# EAGLE design ade7753_breakout (EAGLE 6.5.0)
AUTHOR: Prabal Dutta; REV: a; TITLE: ADE7753 Breakout
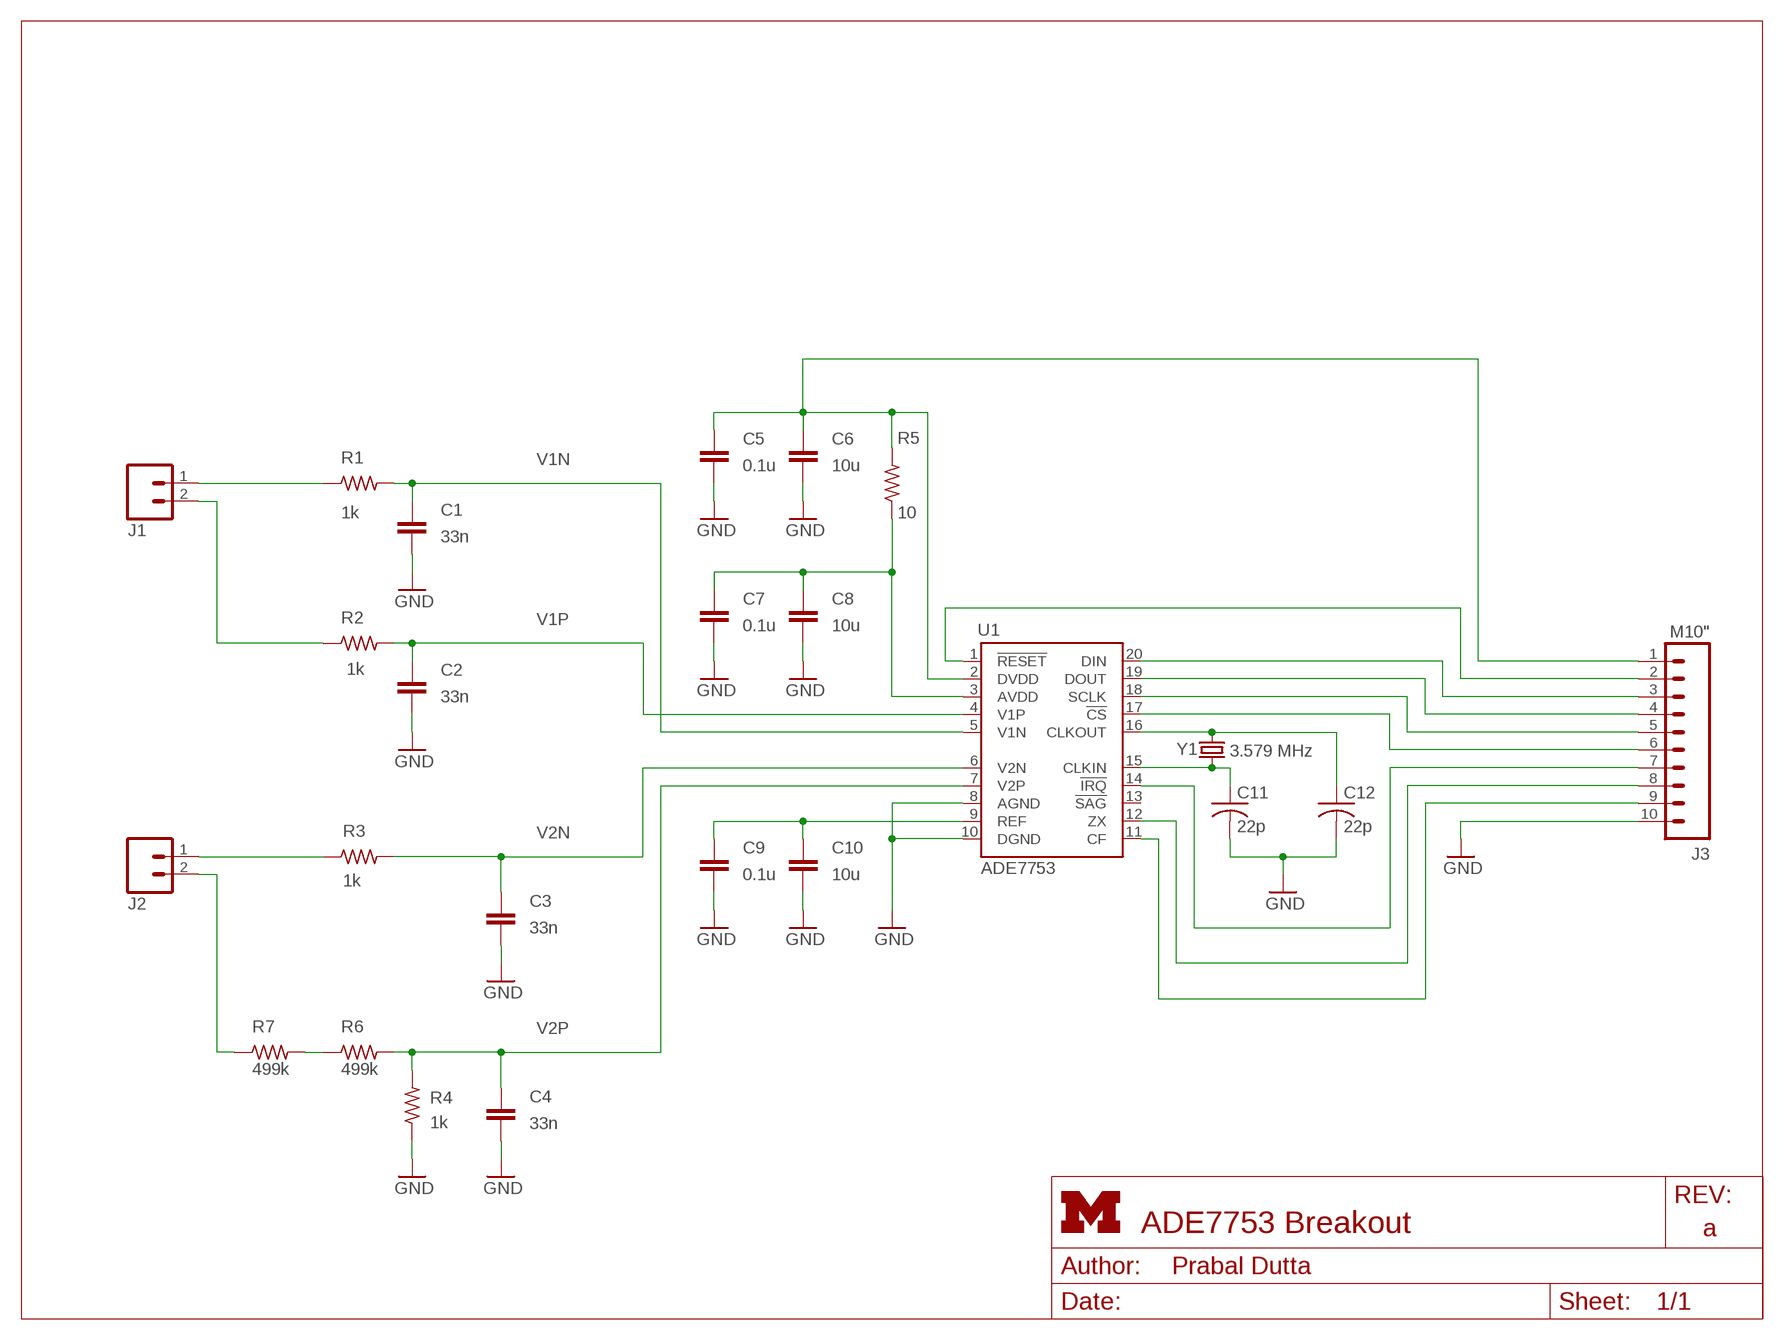
[diagram p0: schematic, sheet 1]
FRAME1 (LETTER_L): HEIGHT: 8.5in; WIDTH: 11in

## Parts
C1  33n  CAP0805  [0805]
C2  33n  CAP0805  [0805]
C3  33n  CAP0805  [0805]
C4  33n  CAP0805  [0805]
C5  0.1u  CAP0805  [0805]
C6  10u  CAP0805  [0805]
C7  0.1u  CAP0805  [0805]
C8  10u  CAP0805  [0805]
C9  0.1u  CAP0805  [0805]
C10  10u  CAP0805  [0805]
C11  22p  C-USC0603  [C0603]
C12  22p  C-USC0603  [C0603]
J1  M02PTH  [1X02]
J2  M02PTH  [1X02]
J3  M10"  [1X10]
R1  1k  R-US_R0603  [R0603]
R2  1k  R-US_R0603  [R0603]
R3  1k  R-US_R0603  [R0603]
R4  1k  R-US_R0603  [R0603]
R5  10  R-US_R0603  [R0603]
R6  499k  R-US_R0805  [R0805]
R7  499k  R-US_R0805  [R0805]
U1  ADE7753  [SSOP20]
Y1  3.579 MHz  CRYSTALHC49S  [HC49/S]

## Nets
GND: C1.2 C2.2 C3.2 C4.2 C5.2 C6.2 C7.2 C8.2 C9.2 C10.2 C11.2 C12.2 J3.10 R4.1 U1.8(AGND) U1.10(DGND)
N$1: J2.2 R7.1
N$2: J1.1 R1.1
N$22: J3.9 U1.11(CF)
N$34: C4.1 R4.2 R6.2 U1.7(V2P)
N$35: C3.1 R3.2 U1.6(V2N)
N$44: C1.1 R1.2 U1.5(V1N)
N$45: R6.1 R7.2
N$46: J1.2 R2.1
N$47: J2.1 R3.1
N$48: C2.1 R2.2 U1.4(V1P)
N$50: C9.1 C10.1 U1.9(REF)
N$51: C11.1 U1.15(CLKIN) Y1.2
N$52: C12.1 U1.16(CLKOUT) Y1.1
N$53: C7.1 C8.1 R5.1 U1.3(AVDD)
N$54: C5.1 C6.1 J3.1 R5.2 U1.2(DVDD)
N$56: J3.3 U1.20(DIN)
N$57: J3.4 U1.19(DOUT)
N$58: J3.5 U1.18(SCLK)
N$59: J3.6 U1.17(!CS)
N$60: J3.2 U1.1(!RESET)
N$61: J3.7 U1.14(!IRQ)
N$62: J3.8 U1.12(ZX)
Unconnected: U1.13(!SAG)

## Notes on the sheet
- V1N
- V1P
- V2N
- V2P

## Library data of the parts
C1-C10 = SparkFun:CAP: Capacitor Standard 0603 ceramic capacitor, and 0.1" leaded capacitor.
C11 C12 = rcl:C-US: CAPACITOR, American symbol
J1 J2 = SparkFun:M02: Header 2 Standard 2-pin 0.1" header. Use with straight break away headers (SKU : PRT-00116), right angle break away headers (PRT-00553), swiss pins (PRT-00743), machine pins (PRT-00117), and female headers (PRT-00115). Molex polarized connector foot print use with SKU : PRT-08233 with associated crimp pins and housings.
J3 = SparkFun:M10: Header 10 Standard 10-pin 0.1" header. Use with straight break away headers (SKU : PRT-00116), right angle break away headers (PRT-00553), swiss pins (PRT-00743), machine pins (PRT-00117), and female headers (PRT-00115).
R1-R7 = rcl:R-US_: RESISTOR, American symbol
U1 = berkeley-epic:ADE7753
Y1 = crystal:CRYSTAL: CRYSTAL

## Board
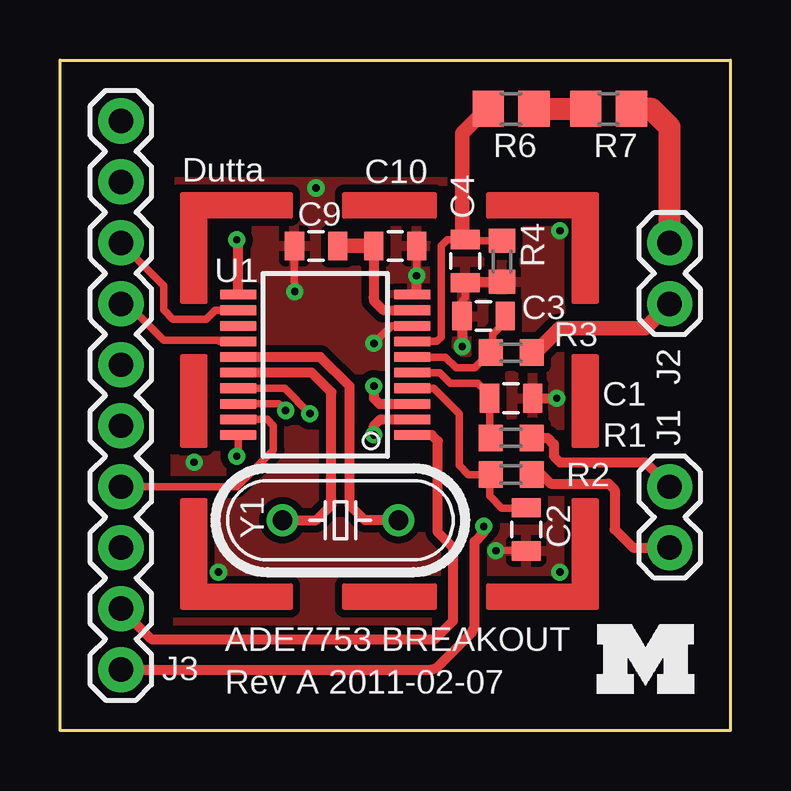
[diagram p1: board, top side]
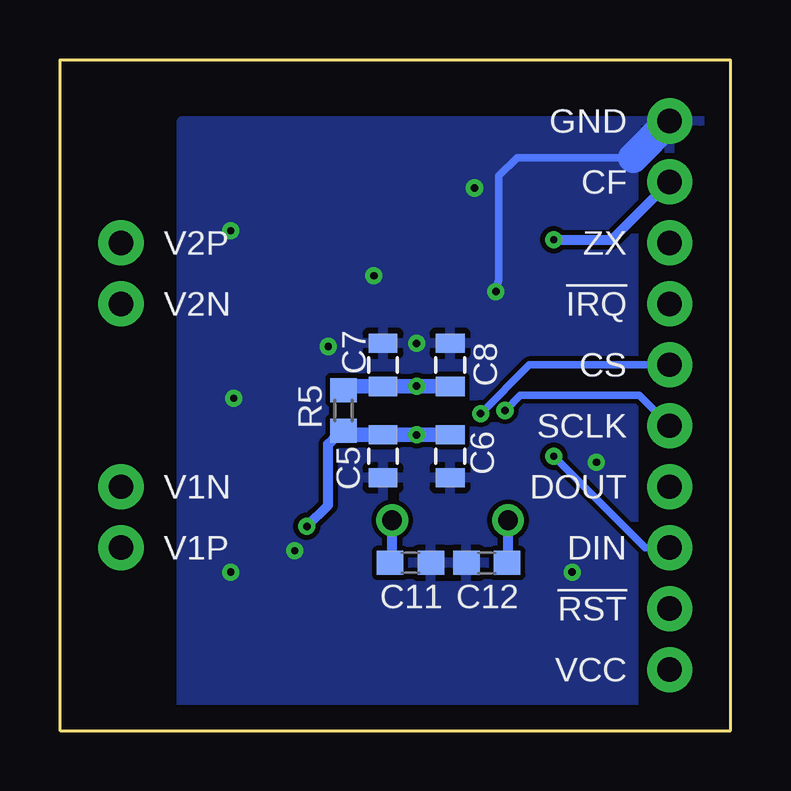
[diagram p2: board, bottom side, seen from below]

Size 27.94 x 27.94 mm. Coordinates in mm from the lower left corner, seen from the top.
Outline: 27.94,0 27.94,27.94 0,27.94 0,0 27.94,0
Copper layers (1*16): Top 0.035mm / dielectric 1.5mm / Bottom 0.035mm
Design rules "default *": minimum track width 10mil, minimum drill 12mil, track to track 8mil, track to pad 8mil, pad to pad 8mil, via to via 8mil, smd to smd 8mil, copper to edge 40mil, drill to drill 8mil, minimum pad ring 10mil, minimum via ring 8mil, stop-mask expansion 4mil, vias tented up to drill 0mil, thermal gap 10mil

### Footprints (pad centres in the part's own frame; a part is rotated, then mirrored left to right if it is on the bottom)
0805 = smd 0.8 x 1.2: 1 -0.9,0; 2 0.9,0
C0603 = smd 1.1 x 1: 1 -0.85,0; 2 0.85,0
1X02 = drill 1.016 pad 1.88: 1 0,0; 2 2.54,0
1X10 = drill 1.016 pad 1.88: 1 0,0; 2 2.54,0; 3 5.08,0; 4 7.62,0; 5 10.16,0; 6 12.7,0; 7 15.24,0; 8 17.78,0; 9 20.32,0; 10 22.86,0
R0603 = smd 1 x 1.1: 1 -0.85,0; 2 0.85,0
R0805 = smd 1.3 x 1.5: 1 -0.95,0; 2 0.95,0
SSOP20 = smd 1.5 x 0.4: 1 -3.625,2.925; 2 -3.625,2.275; 3 -3.625,1.625; 4 -3.625,0.975; 5 -3.625,0.325; 6 -3.625,-0.325; 7 -3.625,-0.975; 8 -3.625,-1.625; 9 -3.625,-2.275; 10 -3.625,-2.925; 11 3.625,-2.925; 12 3.625,-2.275; 13 3.625,-1.625; 14 3.625,-0.975; 15 3.625,-0.325; 16 3.625,0.325; 17 3.625,0.975; 18 3.625,1.625; 19 3.625,2.275; 20 3.625,2.925
HC49/S = drill 0.813: 1 -2.413,0; 2 2.413,0

### Placement (x,y rotation side)
C1  18.8,13.84 0 top
C2  19.43,8.38 270 top
C3  17.65,17.27 180 top
C4  16.89,19.56 270 top
C5  14.48,11.43 270 bottom
C6  11.68,11.43 270 bottom
C7  14.48,15.24 90 bottom
C8  11.68,15.24 90 bottom
C9  10.67,20.19 180 top
C10  13.97,20.19 0 top
C11  13.34,6.99 0 bottom
C12  10.16,6.99 180 bottom
J1  25.4,10.16 270 top
J2  25.4,17.78 90 top
J3  2.54,2.54 90 top
R1  18.8,12.19 180 top
R2  18.8,10.67 180 top
R3  18.8,15.75 180 top
R4  18.41,19.56 90 top
R5  16.13,13.34 270 bottom
R6  18.8,25.91 180 top
R7  22.86,25.91 180 top
U1  11.05,15.24 180 top
U$1  [BLOCK-M]  22.35,1.52 0 top
U$9  [BMIS-202]  5.08,5.08 0 top
Y1  11.68,8.76 0 top

### Tracks (layer width: path | path; a pad name or v marks a point on that pad's centre or on a via)
GND  (via drill 0.3)
  Top 0.305: 19.7,7.5 v18.16,7.49 | C4.2 16.89,18.03 16.75,17.9 C3.2 16.75,17.16 | C10.2 14.87,19.06 v14.86,18.95 | C9.2 9.77,19.06 v9.78,18.29 | 14.86,18.16 U1.10 | U1.8 13.82,16.86 v13.08,16.13
  Top 0.406: C1.2 19.7,13.85 v20.7,13.84 | C2.2 19.7,7.5 | C4.2 16.93,18.71 R4.1 | C3.2 16.76,17.27 | 16.75,17.16 16.76,17.14 v16.76,16 | 14.86,18.16 v14.86,18.95
  Bottom 0.305: 4.06,23.88 8.89,23.88 9.65,23.11 9.65,18.8 v9.78,18.29
  Bottom 1.27: 4.06,23.88 J3.10
  other vias: 10.67,22.61 20.83,20.83 20.83,6.6 6.6,6.6 5.59,11.18
  pour Bottom: 22.86,25.4 0.76,25.4 0.76,24.26 4.06,24.26 4.06,0.76 22.86,0.76
  pour Top (isolate 0.305): 4.83,22.86 22.86,22.86 22.86,4.57 4.83,4.57
N$1
  Top 0.914: J2.2 25.4,25.15 24.64,25.91 R7.1
N$2
  Top 0.406: R1.1 20.32,12.19 20.57,11.94 20.57,11.43 20.83,11.18 24.38,11.18 J1.1
N$22  (via drill 0.3)
  Top 0.406: U1.11 7.42,20.39 v7.37,20.45
  Bottom 0.406: v7.37,20.45 4.95,20.45 J3.9
N$34
  Top 0.305: 16.93,20.41 R4.2 | U1.7 15.71,16.21 15.88,16.38 15.88,20.19 16.13,20.45 16.89,20.45
  Top 0.406: 16.93,20.41 16.89,20.45 C4.1 16.76,20.59 | 17.53,25.65 R6.2
  Top 0.61: 17.53,25.65 16.76,24.89 16.76,20.59
N$35
  Top 0.305: U1.6 16.06,15.56 16.51,15.11 17.27,15.11 17.91,15.75 | C3.1 18.55,17.03 18.03,16.51 18.03,15.75
  Top 0.406: 17.9,15.89 18.03,15.75 R3.2 17.91,15.75
N$44
  Top 0.305: C1.1 17.9,12.33 | U1.5 15.82,14.91 16.26,14.48 17.4,14.48 17.91,13.97
  Top 0.406: R1.2 17.91,12.19 17.9,12.33 | 17.91,13.97 17.9,13.96 C1.1
N$45
  Top 0.914: R6.1 R7.2
N$46
  Top 0.406: R2.1 19.77,10.63 20.07,10.67 20.45,10.29 22.86,10.29 23.11,10.03 23.11,8.38 23.88,7.62 J1.2
N$47
  Top 0.406: R3.1 19.81,15.75
  Top 0.61: 19.81,15.75 20.83,16.76 24.38,16.76 J2.1
N$48
  Top 0.305: 19.68,9.27 18.41,9.27 17.91,9.78 17.91,10.54 | U1.4 15.58,14.27 16.64,13.21 16.64,11.05 17.02,10.67 R2.2
  Top 0.406: 19.68,9.27 C2.1 | R2.2 17.91,10.54
N$50
  Top 0.305: 13.07,20.08 13.08,20.07 | 13.07,20.08 C10.1 | 12.95,20.19 13.07,20.08 | 13.07,18.05 13.08,18.03
  Top 0.406: C10.1 13.07,18.05 | 13.08,18.03 13.08,17.91 13.47,17.52 U1.9
  Top 0.61: C9.1 12.95,20.19
N$51
  Top 0.406: U1.15 10.85,15.56 12.06,14.35 12.06,9.4 12.7,8.76 Y1.2
  Bottom 0.406: C11.1 14.1,6.99 Y1.2
N$52
  Top 0.406: U1.16 10.48,14.91 11.3,14.1 11.3,9.4 10.67,8.76 Y1.1
  Bottom 0.406: C12.1 9.27,6.99 Y1.1
N$53  (via drill 0.3)
  Top 0.406: U1.3 13.31,13.62 13.08,13.84 v13.08,14.35
  Bottom 0.305: 16.13,14.35 R5.1
  Bottom 0.406: v13.08,14.34 v13.08,14.35
  Bottom 0.61: 14.48,14.35 C7.1 | C8.1 v13.08,14.34 14.47,14.34 14.48,14.35 | 14.48,14.35 16.13,14.35
N$54  (via drill 0.3)
  Top 0.406: U1.2 13.35,12.96 13.08,12.7 v13.08,12.32 | v17.65,8.51 17.65,8.26 17.27,7.87 17.27,4.32 17.14,4.06 15.75,2.67 15.49,2.54 J3.1
  Bottom 0.305: R5.2 16.13,12.45 16,12.32
  Bottom 0.406: C5.1 14.47,12.33 | v13.08,12.33 v13.08,12.32 | 16,12.32 16.38,12.32 16.76,11.94 16.76,9.4 v17.65,8.51
  Bottom 0.61: 14.47,12.33 v13.08,12.33 C6.1 | 16,12.32 C5.1
N$56  (via drill 0.3)
  Top 0.305: U1.20 7.42,11.62 v7.37,11.43
  Bottom 0.305: 7.24,11.43 v7.37,11.43 3.56,7.62 J3.3
N$57
  Top 0.305: U1.19 8.62,12.96 8.89,12.7 8.89,11.68 7.37,10.16 J3.4
N$58  (via drill 0.3)
  Top 0.305: U1.18 9.12,13.62 v9.4,13.34
  Bottom 0.305: J3.5 3.81,13.97 8.76,13.97 v9.4,13.34
N$59  (via drill 0.3)
  Top 0.305: U1.17 9.36,14.27 v10.41,13.21
  Bottom 0.305: J3.6 8.38,15.24 v10.41,13.21
N$60
  Top 0.406: U1.1 15.5,12.31 15.75,12.06 15.75,8.26 16.38,7.62 16.38,4.57 15.62,3.81 3.81,3.81 J3.2
N$61
  Top 0.305: U1.14 6.64,16.21 6.6,16.26 4.32,16.26 2.79,17.78 J3.7
N$62
  Top 0.305: U1.12 6.47,17.52 6.1,17.14 4.7,17.14 4.32,17.53 4.32,18.54 J3.8

### Text on the board
tPlace: Dutta | ADE7753 BREAKOUT | Rev A 2011-02-07
bPlace: GND | CF | ZX | V2P | !IRQ | V2N | CS | SCLK | DOUT | V1N | DIN | V1P | !RST | VCC